# EAGLE design additionalShield (EAGLE 6.5.0)
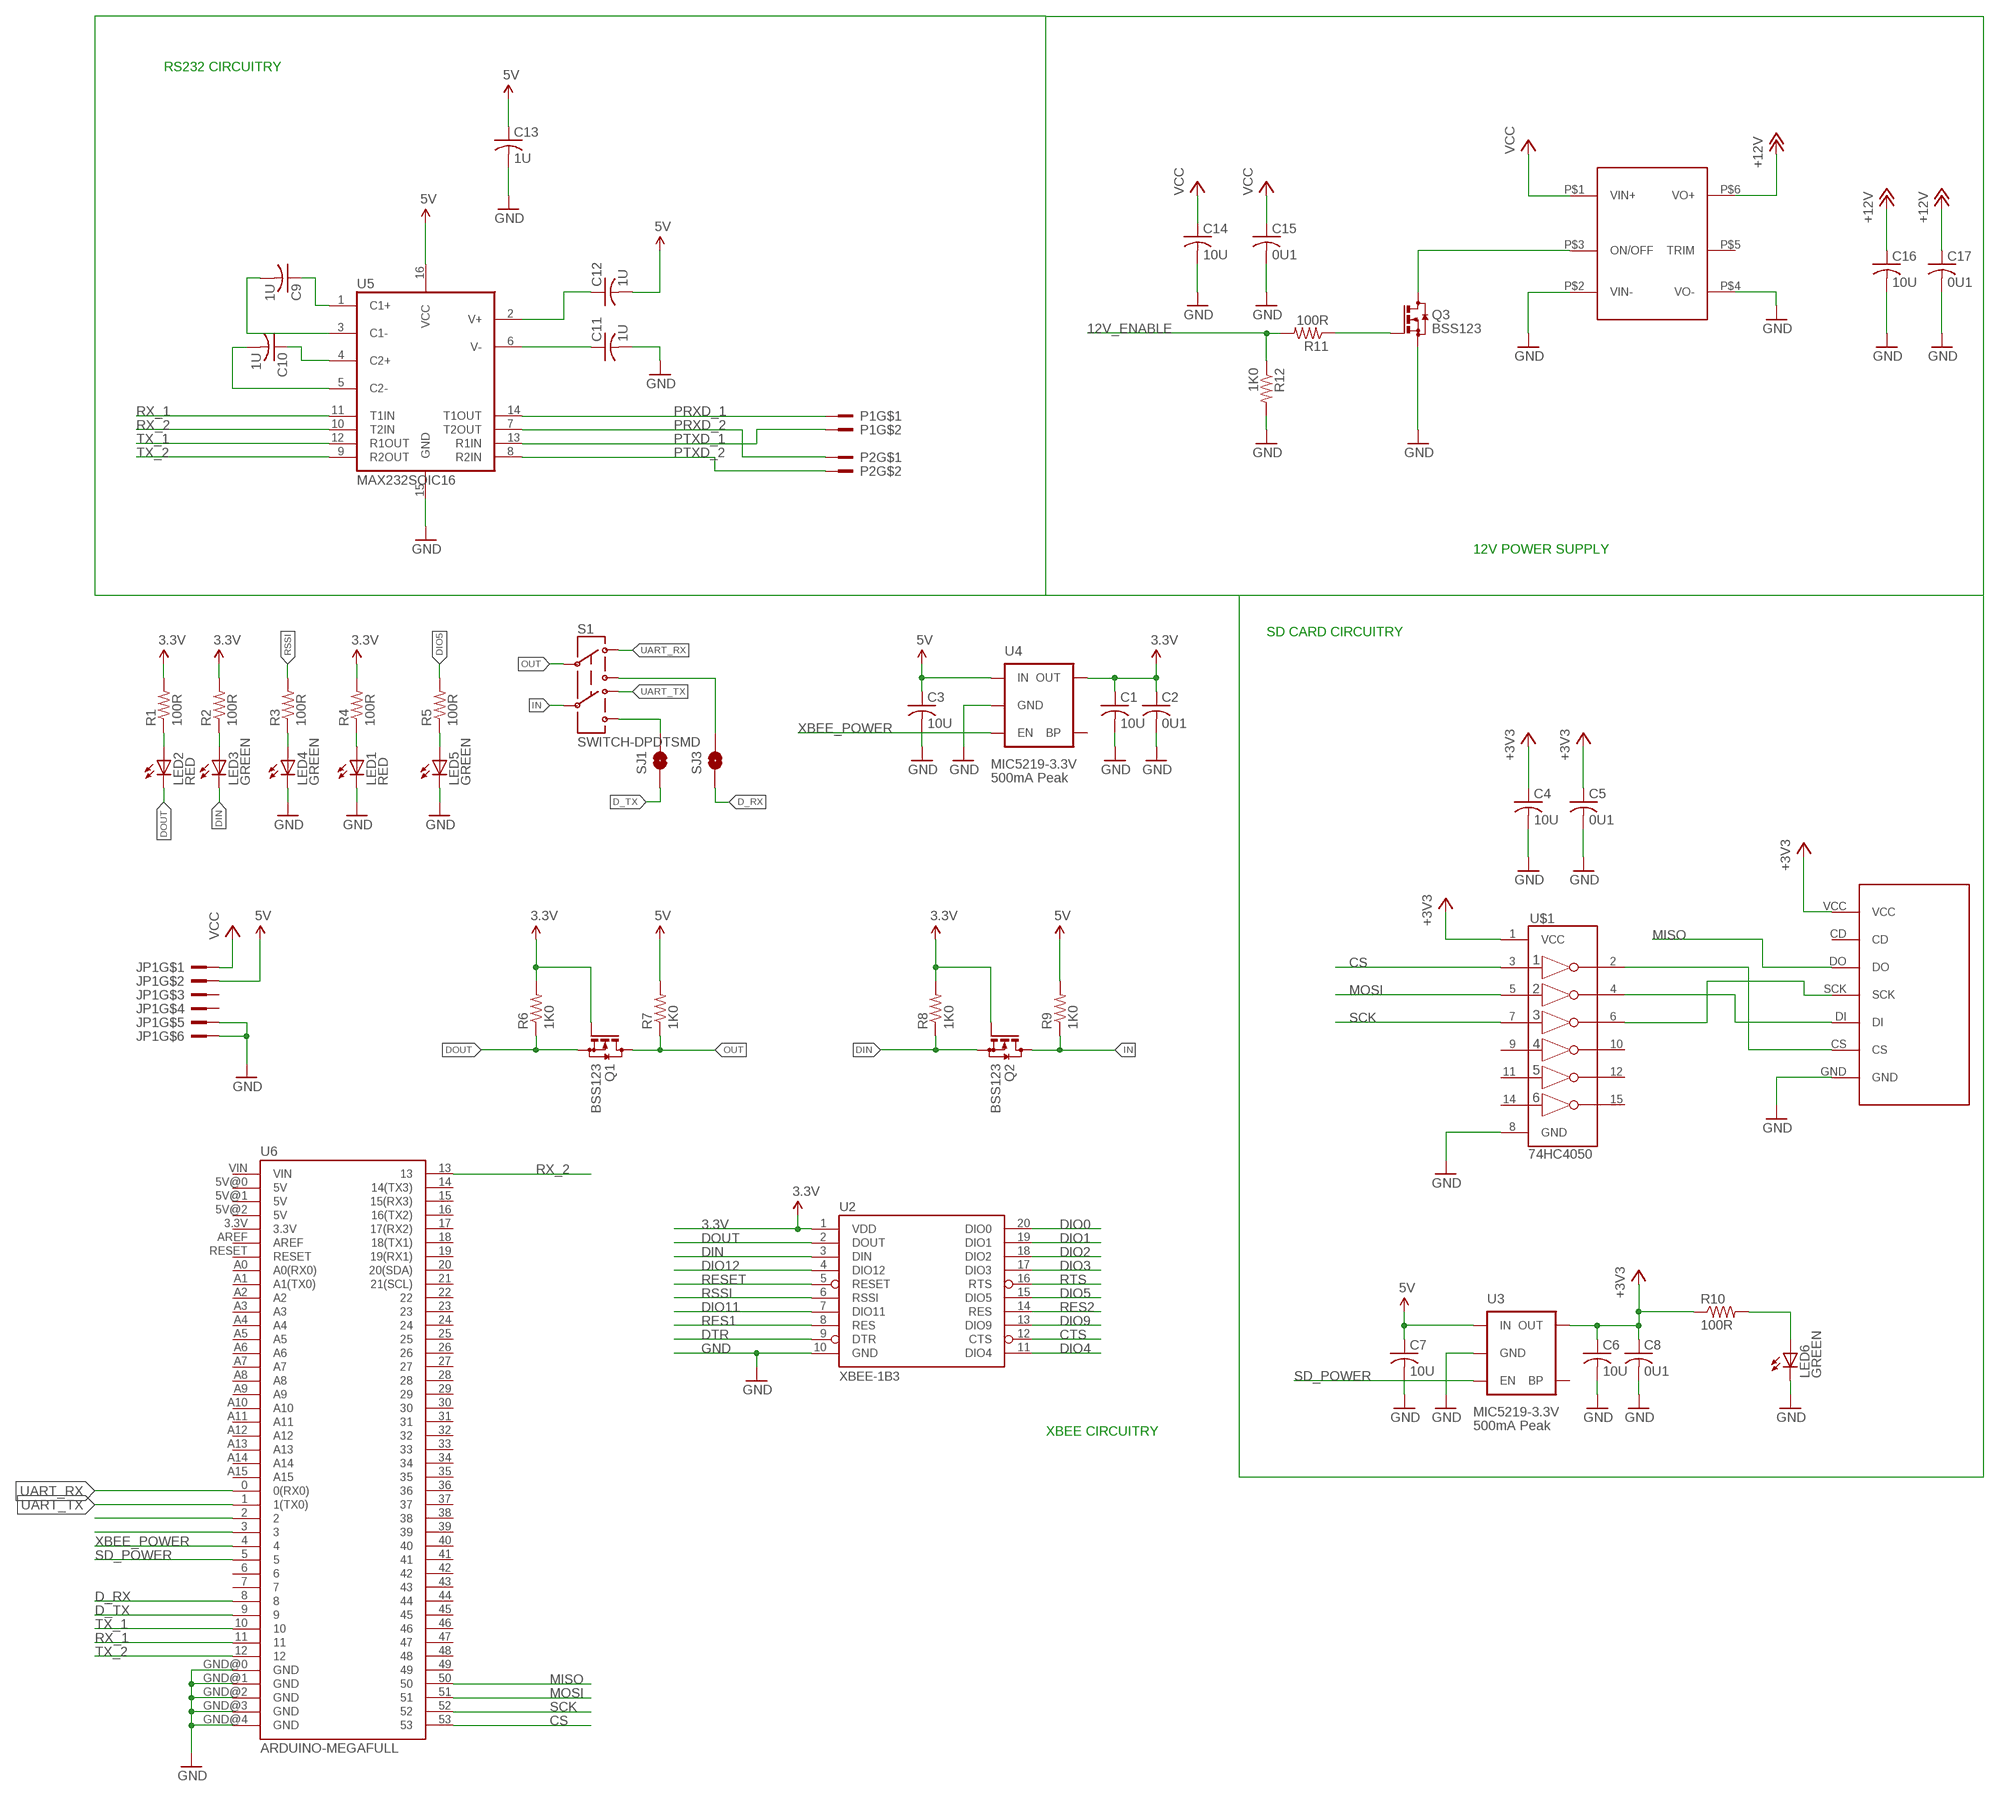
[diagram p0: schematic, sheet 1]

## Parts
C1  10U  C-USC1210K  [C1210K]
C2  0U1  C-USC1210K  [C1210K]
C3  10U  C-USC1210K  [C1210K]
C4  10U  C-USC1210K  [C1210K]
C5  0U1  C-USC1210K  [C1210K]
C6  10U  C-USC1210K  [C1210K]
C7  10U  C-USC1210K  [C1210K]
C8  0U1  C-USC1210K  [C1210K]
C9  1U  C-USC1210K  [C1210K]
C10  1U  C-USC1210K  [C1210K]
C11  1U  C-USC1210K  [C1210K]
C12  1U  C-USC1210K  [C1210K]
C13  1U  C-USC1210K  [C1210K]
C14  10U  C-USC1210K  [C1210K]
C15  0U1  C-USC1210K  [C1210K]
C16  10U  C-USC1210K  [C1210K]
C17  0U1  C-USC1210K  [C1210K]
JP1  6PIN2ROWARDUINO  [6PIN2ROWARDUINO]
LED1  RED  LEDCHIPLED_1206  [CHIPLED_1206]
LED2  RED  LEDCHIPLED_1206  [CHIPLED_1206]
LED3  GREEN  LEDCHIPLED_1206  [CHIPLED_1206]
LED4  GREEN  LEDCHIPLED_1206  [CHIPLED_1206]
LED5  GREEN  LEDCHIPLED_1206  [CHIPLED_1206]
LED6  GREEN  LEDCHIPLED_1206  [CHIPLED_1206]
P1  DF3A-2P-2DSA  [DF3A-2P-2DSA]
P2  DF3A-2P-2DSA  [DF3A-2P-2DSA]
Q1  BSS123  [SOT23]
Q2  BSS123  [SOT23]
Q3  BSS123  [SOT23]
R1  100R  R-US_R1206  [R1206]
R2  100R  R-US_R1206  [R1206]
R3  100R  R-US_R1206  [R1206]
R4  100R  R-US_R1206  [R1206]
R5  100R  R-US_R1206  [R1206]
R6  1K0  R-US_R1206  [R1206]
R7  1K0  R-US_R1206  [R1206]
R8  1K0  R-US_R1206  [R1206]
R9  1K0  R-US_R1206  [R1206]
R10  100R  R-US_R1206  [R1206]
R11  100R  R-US_R1206  [R1206]
R12  1K0  R-US_R1206  [R1206]
S1  SWITCH-DPDTSMD  [AYZ0202]
SJ1  D_TX  SOLDERJUMPERNC  [SJ_2S]
SJ3  D_RX  SOLDERJUMPERNC  [SJ_2S]
U2  XBEE-1B3  [XBEE-SMD]
U3  V_REG_LDOSMD  [SOT23-5]
U4  V_REG_LDOSMD  [SOT23-5]
U5  MAX232SOIC16  [SO016]
U6  ARDUINO-MEGAFULL  [ARDUINO_MEGA]
U$1  74HC4050  [SO16]
U$5  SD_BREAKOUT  [SD_BREAKOUT]
U$11  SHHD001A3B41Z  [SHHD001A3B41Z]

## Nets
3.3V: C1.1 C2.1 Q1.1(G) Q2.1(G) R1.2 R2.2 R4.2 R6.2 R8.2 U2.1(VDD) U4.5(OUT)
5V: C3.1 C7.1 C12.2 C13.1 JP1.P$2 R7.2 R9.2 U3.1(IN) U4.1(IN) U5.16(VCC)
12V_ENABLE: R11.2 R12.1
+3V3: C4.1 C5.1 C6.1 C8.1 R10.1 U3.5(OUT) U$1.1(VCC) U$5.VCC
+12V: C16.1 C17.1 U$11.P$6(VO+)
CS: U6.53 U$1.3(1A)
CTS: U2.12(CTS)
D_RX: SJ3.1 U6.8
D_TX: SJ1.1 U6.9
DIN: LED3.C Q2.2(S) R8.1 U2.3(DIN)
DIO0: U2.20(DIO0)
DIO1: U2.19(DIO1)
DIO2: U2.18(DIO2)
DIO3: U2.17(DIO3)
DIO4: U2.11(DIO4)
DIO5: R5.2 U2.15(DIO5)
DIO9: U2.13(DIO9)
DIO11: U2.7(DIO11)
DIO12: U2.4(DIO12)
DOUT: LED2.C Q1.2(S) R6.1 U2.2(DOUT)
DTR: U2.9(DTR)
GND: C1.2 C2.2 C3.2 C4.2 C5.2 C6.2 C7.2 C8.2 C11.2 C13.2 C14.2 C15.2 C16.2 C17.2 JP1.P$5 JP1.P$6 LED1.C LED4.C LED5.C LED6.C Q3.2(S) R12.2 U2.10(GND) U3.2(GND) U4.2(GND) U5.15(GND) U6.GND@0(GND) U6.GND@1(GND) U6.GND@2(GND) U6.GND@3(GND) U6.GND@4(GND) U$1.8(GND) U$5.GND U$11.P$2(VIN-) U$11.P$4(VO-)
IN: Q2.3(D) R9.1 S1.5
MISO: U6.50 U$5.DO
MOSI: U6.51 U$1.5(2A)
N$1: LED2.A R1.1
N$2: LED4.A R3.1
N$4: LED3.A R2.1
N$5: LED6.A R10.2
N$6: U$1.2(1Y) U$5.CS
N$7: U$1.4(2Y) U$5.DI
N$8: U$1.6(3Y) U$5.SCK
N$13: C9.1 U5.1(C1+)
N$14: C9.2 U5.3(C1-)
N$15: C10.1 U5.4(C2+)
N$16: C10.2 U5.5(C2-)
N$17: C11.1 U5.6(V-)
N$18: C12.1 U5.2(V+)
N$23: Q3.1(G) R11.1
N$24: U6.2
N$25: Q3.3(D) U$11.P$3(ON/OFF)
N$26: U6.3
N$38: LED1.A R4.1
N$139: LED5.A R5.1
N$140: S1.6 SJ1.2
N$141: S1.3 SJ3.2
OUT: Q1.3(D) R7.1 S1.2
PRXD_1: P1.P$1 U5.14(T1OUT)
PRXD_2: P2.P$1 U5.7(T2OUT)
PTXD_1: P1.P$2 U5.13(R1IN)
PTXD_2: P2.P$2 U5.8(R2IN)
RES1: U2.8(RES)
RES2: U2.14(RES)
RESET: U2.5(RESET)
RSSI: R3.2 U2.6(RSSI)
RTS: U2.16(RTS)
RX_1: U5.11(T1IN) U6.11
RX_2: U5.10(T2IN) U6.13
SCK: U6.52 U$1.7(3A)
SD_POWER: U3.3(EN) U6.5
TX_1: U5.12(R1OUT) U6.10
TX_2: U5.9(R2OUT) U6.12
UART_RX: S1.1 U6.0(0(RX0))
UART_TX: S1.4 U6.1(1(TX0))
VCC: C14.1 C15.1 JP1.P$1 U$11.P$1(VIN+)
XBEE_POWER: U4.3(EN) U6.4
Unconnected: JP1.P$3 JP1.P$4 U3.4(BP) U4.4(BP) U6.3.3V U6.5V@0(5V) U6.5V@1(5V) U6.5V@2(5V) U6.6 U6.7 U6.14(14(TX3)) U6.15(15(RX3)) U6.16(16(TX2)) U6.17(17(RX2)) U6.18(18(TX1)) U6.19(19(RX1)) U6.20(20(SDA)) U6.21(21(SCL)) U6.22 U6.23 U6.24 U6.25 U6.26 U6.27 U6.28 U6.29 U6.30 U6.31 U6.32 U6.33 U6.34 U6.35 U6.36 U6.37 U6.38 U6.39 U6.40 U6.41 U6.42 U6.43 U6.44 U6.45 U6.46 U6.47 U6.48 U6.49 U6.A0(A0(RX0)) U6.A1(A1(TX0)) U6.A2 U6.A3 U6.A4 U6.A5 U6.A6 U6.A7 U6.A8 U6.A9 U6.A10 U6.A11 U6.A12 U6.A13 U6.A14 U6.A15 U6.AREF U6.RESET U6.VIN U$1.9(4A) U$1.10(4Y) U$1.11(5A) U$1.12(5Y) U$1.14(6A) U$1.15(6Y) U$5.CD U$11.P$5(TRIM)

## Notes on the sheet
- RS232 CIRCUITRY
- 12V POWER SUPPLY
- SD CARD CIRCUITRY
- MIC5219-3.3V
- 500mA Peak
- MIC5219-3.3V
- 500mA Peak
- XBEE CIRCUITRY

## Library data of the parts
C1-C17 = resistor:C-US: CAPACITOR, American symbol
JP1 = con-3m:6PIN2ROWARDUINO
LED1-LED6 = led:LED: LED OSRAM: - CHIPLED LG R971, LG N971, LY N971, LG Q971, LY Q971, LO R971, LY R971 LH N974, LH R974 LS Q976, LO Q976, LY Q976 LO Q996 - Hyper CHIPLED LW Q18S LB Q993, LB Q99A, LB R99A - SideLED LS A670, LO A670, LY A670, LG A670, LP A670 LB A673, LV A673, LT A673, LW A673 LH A674 LY A675 LS A676, LA A676, LO A676, LY A676, LW A676 LS A679, LY A679, LG A679 - Hyper Micro SIDELED® LS Y876, LA Y876, LO Y876, LY Y876 LT Y87S - SmartLED LW L88C, LW L88S LB L89C, LB L89S, LG L890 LS L89K, LO L89K, LY L89K LS L896, LA L896, LO L896, LY L896 - TOPLED LS T670, LO T670, LY T670, LG T670, LP T670 LSG T670, LSP T670, LSY T670, LOP T670, LYG T670 LG T671, LOG T671, LSG T671 LB T673, LV T673, LT T673, LW T673 LH T674 LS T676, LA T676, LO T676, LY T676, LB T676, LH T676, LSB T676, LW T676 LB T67C, LV T67C, LT T67C, LS T67K, LO T67K, LY T67K, LW E67C LS E67B, LA E67B, LO E67B, LY E67B, LB E67C, LV E67C, LT E67C LW T67C LS T679, LY T679, LG T679 LS T770, LO T770, LY T770, LG T770, LP T770 LB T773, LV T773, LT T773, LW T773 LH T774 LS E675, LA E675, LY E675, LS T675 LS T776, LA T776, LO T776, LY T776, LB T776 LHGB T686 LT T68C, LB T68C - Hyper Mini TOPLED® LB M676 - Mini TOPLED Santana® LG M470 LS M47K, LO M47K, LY M47K Source: http://www.osram.convergy.de LUXEON: - LUMILED® LXK2-PW12-R00, LXK2-PW12-S00, LXK2-PW14-U00, LXK2-PW14-V00 LXK2-PM12-R00, LXK2-PM12-S00, LXK2-PM14-U00 LXK2-PE12-Q00, LXK2-PE12-R00, LXK2-PE12-S00, LXK2-PE14-T00, LXK2-PE14-U00 LXK2-PB12-K00, LXK2-PB12-L00, LXK2-PB12-M00, LXK2-PB14-N00, LXK2-PB14-P00, LXK2-PB14-Q00 LXK2-PR12-L00, LXK2-PR12-M00, LXK2-PR14-Q00, LXK2-PR14-R00 LXK2-PD12-Q00, LXK2-PD12-R00, LXK2-PD12-S00 LXK2-PH12-R00, LXK2-PH12-S00 LXK2-PL12-P00, LXK2-PL12-Q00, LXK2-PL12-R00 Source: www.luxeon.com KINGBRIGHT: KA-3528ASYC Source: www.kingbright.com
P1 P2 = con-3m:DF3A-2P-2DSA
Q1-Q3 = transistor-small-signal:BSS123: N-CHANNEL MOS FET
R1-R12 = resistor:R-US_: RESISTOR, American symbol
S1 = SparkFun:SWITCH-DPDT: DPDT Version of the COM-00597
SJ1 SJ3 = SparkFun:SOLDERJUMPER: Solder Jumper Standard SMD solder jumper. Used to automate production. Two varients : Normally Open and Normally Closed are the same, but have different paste layers. NC will have a large amount of paste and should jumper during reflow.
U2 = SparkFun:XBEE-1
U3 U4 = SparkFun-PowerIC:V_REG_LDO: Voltage Regulator LDO Standard 150mA LDO voltage regulator in SOT-23 layout. Micrel part MIC5205. BP (by-pass) pin is used to lower output noise with 470pF cap.
U5 = SparkFun-DigitalIC:MAX232: RS232 Transceiver Very common IC. This is generically called 'MAX232', but works with the 3V equivalent MAX3232 generic ICs. Field tested and mother approved. Spark Fun Electronics SKU : COM-00316 (DIP) and COM-00589 (SMD)
U6 = SparkFun-Boards:ARDUINO-MEGA: Arduino Mega board footprint
U$1 = SparkFun-DigitalIC:74HC4050
U$5 = SparkFun-Boards:SD_BREAKOUT
U$11 = dc-dc-converter:SHHD001A3B41Z

## Net classes
0 default: width 0.203 mm
1 vcc: width 0.305 mm

## Board
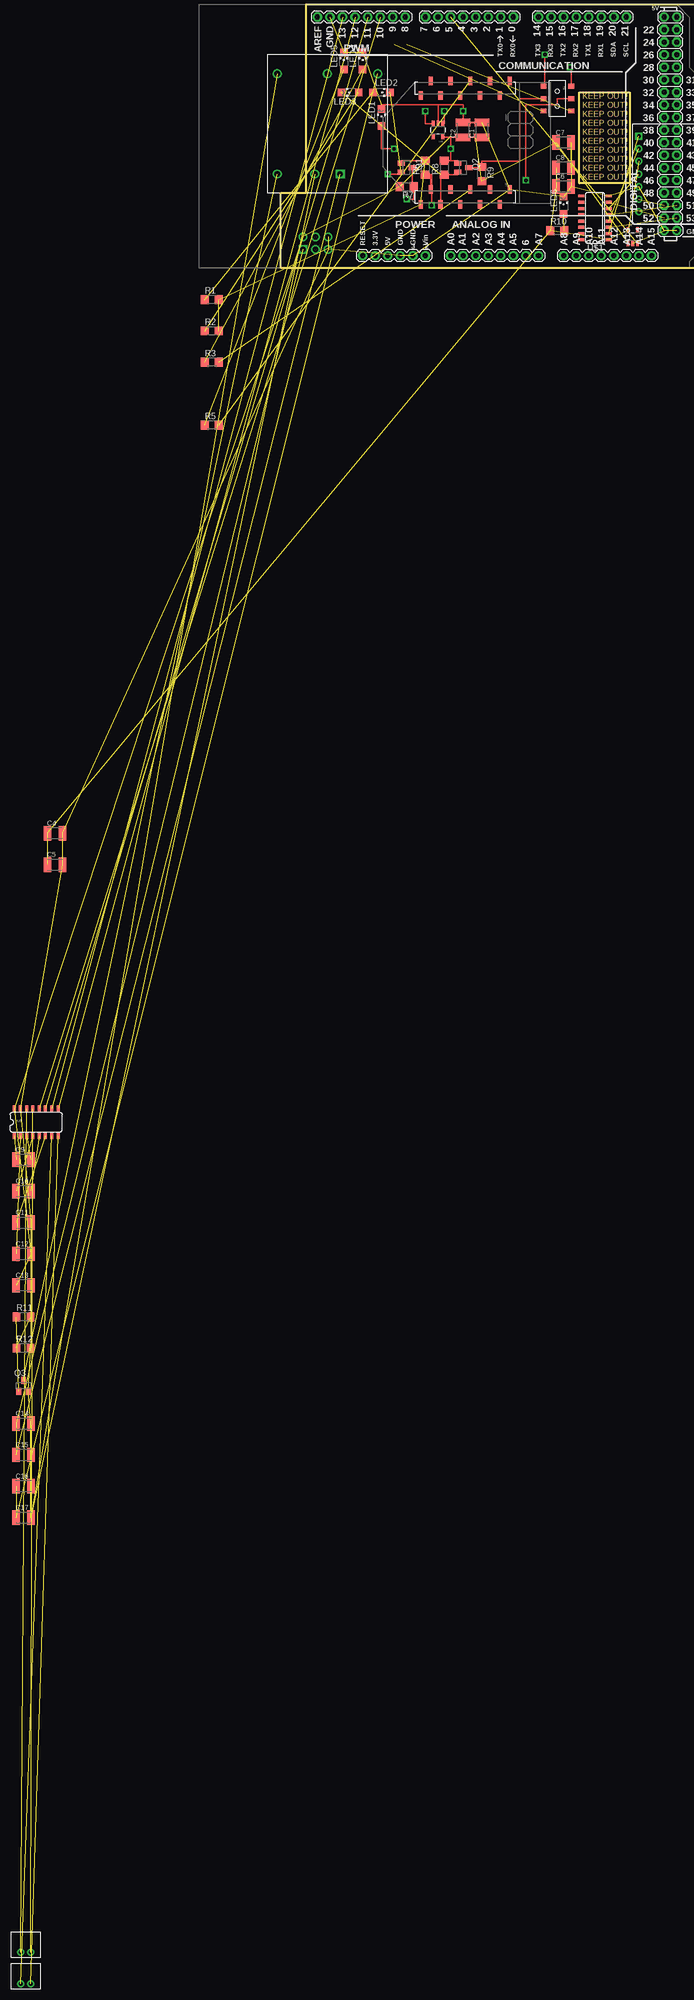
[diagram p1: board, top side]
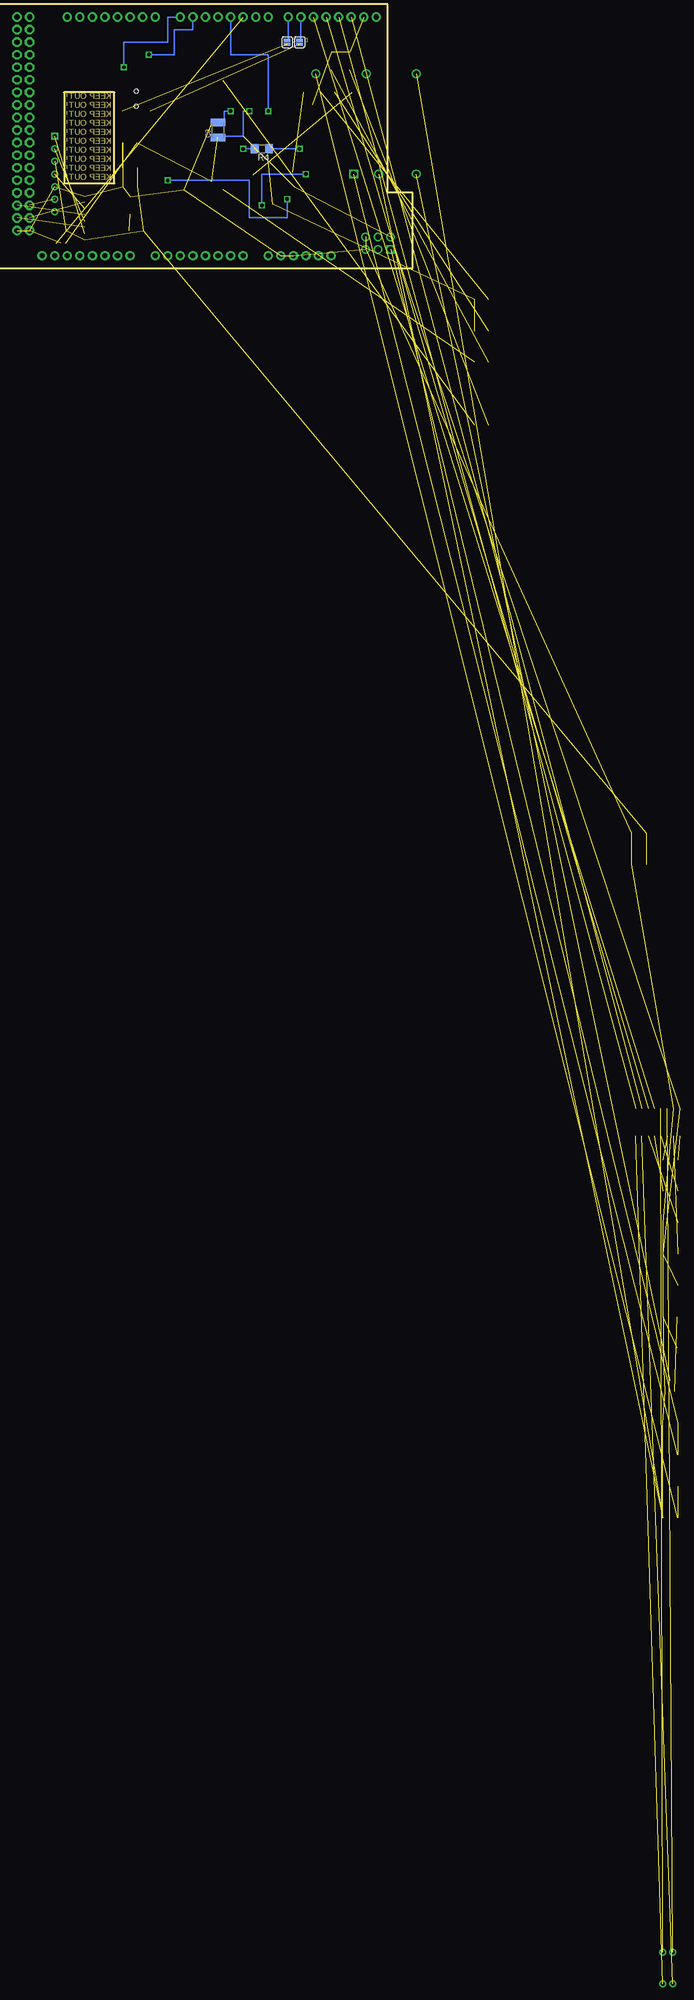
[diagram p2: board, bottom side, seen from below]

No outline drawn. Coordinates in mm, seen from the top.
Copper layers (1*16): Top 0.035mm / dielectric 1.5mm / Bottom 0.035mm
Design rules "SparkFun-2-layer": minimum track width 7mil, minimum drill 15mil, track to track 8mil, track to pad 8mil, pad to pad 8mil, via to via 8mil, smd to smd 8mil, copper to edge 8mil, drill to drill 8mil, minimum pad ring 12mil, minimum via ring 10mil, stop-mask expansion 4mil, vias tented up to drill 20mil, thermal gap 10mil
Milling: 10 lines

### Footprints (pad centres in the part's own frame; a part is rotated, then mirrored left to right if it is on the bottom)
C1210K = smd 1.5 x 2.9: 1 -1.5,0; 2 1.5,0
6PIN2ROWARDUINO = drill 1.1 square: P$1 0,0 | drill 1.1: P$2 0,2.54; P$3 2.54,0; P$4 2.54,2.54; P$5 5.08,0; P$6 5.08,2.54
CHIPLED_1206 = smd 1.5 x 1.5: A 0,-1.75; C 0,1.75
DF3A-2P-2DSA = drill 0.8: P$1 2,1.001; P$2 4,1.001
SOT23 = smd 1 x 1.4: 1 -0.95,-1.1; 2 0.95,-1.1; 3 0,1.1
R1206 = smd 1.6 x 1.803: 1 -1.422,0; 2 1.422,0
AYZ0202 = smd 1 x 1.15: 1 -2.5,2.825; 2 0,2.825; 3 2.5,2.825; 4 -2.5,-2.825; 5 0,-2.825; 6 2.5,-2.825 | hole 0.85: 1.5,0; -1.5,0
SJ_2S = smd 0.635 x 1.27: 1 -0.412,0; 2 0.412,0
XBEE-SMD = smd 1.7 x 0.85: 1 -12.5,20; 2 -9.5,18; 3 -12.5,16; 4 -9.5,14; 5 -12.5,12; 6 -9.5,10; 7 -12.5,8; 8 -9.5,6; 9 -12.5,4; 10 -9.5,2; 11 12.5,2; 12 9.5,4; 13 12.5,6; 14 9.5,8; 15 12.5,10; 16 9.5,12; 17 12.5,14; 18 9.5,16; 19 12.5,18; 20 9.5,20
SOT23-5 = smd 0.55 x 1.2: 1 -0.95,-1.3; 2 0,-1.3; 3 0.95,-1.3; 4 0.95,1.3; 5 -0.95,1.3
SO016 = smd 0.6 x 1.2: 1 -4.445,-2.8; 2 -3.175,-2.8; 3 -1.905,-2.8; 4 -0.635,-2.8; 5 0.635,-2.8; 6 1.905,-2.8; 7 3.175,-2.8; 8 4.445,-2.8; 9 4.445,2.8; 10 3.175,2.8; 11 1.905,2.8; 12 0.635,2.8; 13 -0.635,2.8; 14 -1.905,2.8; 15 -3.175,2.8; 16 -4.445,2.8
ARDUINO_MEGA = drill 1.016 pad 1.88: 0 63.5,50.8; 1 60.96,50.8; 2 58.42,50.8; 3 55.88,50.8; 3.3V 35.56,2.54; 4 53.34,50.8; 5 50.8,50.8; 5V@0 38.1,2.54; 5V@1 93.98,50.8; 5V@2 96.52,50.8; 6 48.26,50.8; 7 45.72,50.8; 8 41.656,50.8; 9 39.116,50.8; 10 36.576,50.8; 11 34.036,50.8; 12 31.496,50.8; 13 28.956,50.8; 14 68.58,50.8; 15 71.12,50.8; 16 73.66,50.8; 17 76.2,50.8; 18 78.74,50.8; 19 81.28,50.8; 20 83.82,50.8; 21 86.36,50.8; A0 50.8,2.54; A1 53.34,2.54; A2 55.88,2.54; A3 58.42,2.54; A4 60.96,2.54; A5 63.5,2.54; A6 66.04,2.54; A7 68.58,2.54; A8 73.66,2.54; A9 76.2,2.54; A10 78.74,2.54; A11 81.28,2.54; A12 83.82,2.54; A13 86.36,2.54; A14 88.9,2.54; A15 91.44,2.54; AREF 23.876,50.8; GND@0 40.64,2.54; GND@1 43.18,2.54; GND@2 93.98,7.62; GND@3 96.52,7.62; GND@4 26.416,50.8; RESET 33.02,2.54; VIN 45.72,2.54 | drill 1.016 pad 1.88 octagon: 22 93.98,48.26; 23 96.52,48.26; 24 93.98,45.72; 25 96.52,45.72; 26 93.98,43.18; 27 96.52,43.18; 28 93.98,40.64; 29 96.52,40.64; 30 93.98,38.1; 31 96.52,38.1; 32 93.98,35.56; 33 96.52,35.56; 34 93.98,33.02; 35 96.52,33.02; 36 93.98,30.48; 37 96.52,30.48; 38 93.98,27.94; 39 96.52,27.94; 40 93.98,25.4; 41 96.52,25.4; 42 93.98,22.86; 43 96.52,22.86; 44 93.98,20.32; 45 96.52,20.32; 46 93.98,17.78; 47 96.52,17.78; 48 93.98,15.24; 49 96.52,15.24; 50 93.98,12.7; 51 96.52,12.7; 52 93.98,10.16; 53 96.52,10.16
SO16 = smd 0.6 x 1.2: 1 -4.445,-2.8; 2 -3.175,-2.8; 3 -1.905,-2.8; 4 -0.635,-2.8; 5 0.635,-2.8; 6 1.905,-2.8; 7 3.175,-2.8; 8 4.445,-2.8; 9 4.445,2.8; 10 3.175,2.8; 11 1.905,2.8; 12 0.635,2.8; 13 -0.635,2.8; 14 -1.905,2.8; 15 -3.175,2.8; 16 -4.445,2.8
SD_BREAKOUT = drill 0.8: CD 0,15.24; DI 0,2.54; DO 0,12.7; GND 0,10.16; SCK 0,7.62; VCC 0,5.08 | drill 0.8 square: CS 0,0
SHHD001A3B41Z = drill 1.2 square: P$1 3.81,9.652 | drill 1.2: P$2 3.81,14.732; P$3 3.81,22.352; P$4 24.13,22.352; P$5 24.13,12.192; P$6 24.13,2.032

### Placement (x,y rotation side)
C1  57.15,27.94 90 top
C2  53.34,27.94 90 top
C3  55.88,27.94 90 bottom
C4  -29.21,-114.3 0 top
C5  -29.21,-120.65 0 top
C6  73.66,16.51 0 top
C7  73.66,25.4 0 top
C8  73.66,20.32 0 top
C9  -35.56,-180.34 0 top
C10  -35.56,-186.69 0 top
C11  -35.56,-193.04 0 top
C12  -35.56,-199.39 0 top
C13  -35.56,-205.74 0 top
C14  -35.56,-233.68 0 top
C15  -35.56,-240.03 0 top
C16  -35.56,-246.38 0 top
C17  -35.56,-252.73 0 top
JP1  20.95,3.81 0 top
LED1  36.83,30.48 0 top
LED2  36.83,35.56 270 top
LED3  30.48,35.56 90 top
LED4  33.02,41.91 0 top
LED5  29.21,41.91 0 top
LED6  73.66,12.7 0 top
P1  -38.1,-341.63 0 top
P2  -38.1,-347.98 0 top
Q1  41.91,20.32 270 top
Q2  53.34,20.32 270 top
Q3  -35.56,-226.06 0 top
R1  2.54,-6.35 0 top
R2  2.54,-12.7 0 top
R3  2.54,-19.05 0 top
R4  46.99,24.13 180 bottom
R5  2.54,-31.75 0 top
R6  45.72,20.32 90 top
R7  41.91,16.51 180 top
R8  49.53,20.32 90 top
R9  57.15,19.05 270 top
R10  72.39,7.62 0 top
R11  -35.56,-212.09 0 top
R12  -35.56,-218.44 0 top
S1  72.39,34.29 270 top
SJ1  39.37,45.72 270 bottom
SJ3  41.91,45.72 270 bottom
U2  64.77,25.4 90 top
U3  87.63,6.35 0 top
U4  48.26,27.94 180 top
U5  -33.02,-172.72 0 top
U6  0,0 0 top
U$1  80.01,10.16 90 top
U$5  88.9,26.67 180 top
U$11  38.1,15.24 90 top

### Tracks (layer width: path | path; a pad name or v marks a point on that pad's centre or on a via)
3.3V  (via drill 0.7)  (4 unrouted)
  Top 0.254: C1.1 C2.1 50.8,26.44 | 50.8,26.44 49.21,26.44 U4.5 | Q2.1 52.24,21.74 R8.2 50.8,21.74 v50.8,24.13 50.8,26.44 | R6.2 40.81,21.74 Q1.1
  Bottom 0.254: R4.2 v50.8,24.13
5V  (via drill 0.7)  (8 unrouted)
  Top 0.254: U4.1 49.53,29.24 v49.53,31.75
  Bottom 0.254: v49.53,31.75 50.8,31.75 50.8,26.67 55.88,26.67 C3.1
12V_ENABLE  (1 unrouted)
+3V3  (7 unrouted)
+12V  (2 unrouted)
CS  (1 unrouted)
D_RX
  Bottom 0.254: SJ3.1 41.66,46.13 U6.8
D_TX
  Bottom 0.254: SJ1.1 39.12,46.13 U6.9
DIN  (1 unrouted)
  Top 0.254: Q2.2 52.24,18.9 R8.1 48.77,18.9 U2.3
DIO5  (1 unrouted)
DOUT  (via drill 0.7)  (1 unrouted)
  Top 0.254: U2.2 46.77,18.9 R6.1 46.99,18.9 v46.99,12.7 | v38.1,19.05 40.81,19.05 Q1.2
  Bottom 0.254: v46.99,12.7 46.99,19.05 v38.1,19.05
GND  (via drill 0.7)  (30 unrouted)
  Top 0.254: C2.2 v53.34,31.75 53.34,33.02 48.26,33.02 | U4.2 48.26,33.02 | LED1.C 36.83,33.02 48.26,33.02
  Top 0.406: C1.2 C2.2
  Bottom 0.254: v53.34,31.75 54.61,31.75 54.61,29.21 55.88,29.21 C3.2
IN
  Top 0.254: Q2.3 57.15,20.32 R9.1 57.15,21.59 64.77,21.59 64.77,34.29 S1.5
MISO  (1 unrouted)
MOSI  (1 unrouted)
N$1  (1 unrouted)
N$2  (1 unrouted)
N$4  (1 unrouted)
N$5  (1 unrouted)
N$6  (1 unrouted)
N$7  (1 unrouted)
N$8  (1 unrouted)
N$13  (1 unrouted)
N$14  (1 unrouted)
N$15  (1 unrouted)
N$16  (1 unrouted)
N$17  (1 unrouted)
N$18  (1 unrouted)
N$23  (1 unrouted)
N$25  (1 unrouted)
N$38  (via drill 0.7)
  Top 0.254: v39.37,24.13 36.83,24.13 LED1.A
  Bottom 0.254: R4.1 v39.37,24.13
N$139  (1 unrouted)
N$140  (1 unrouted)
N$141  (1 unrouted)
OUT  (via drill 0.7)
  Top 0.254: Q1.3 43.01,16.51 R7.1 43.33,13.97 v41.91,13.97 | S1.2 72.39,34.29 72.39,33.02 66.04,33.02 v66.04,17.78
  Bottom 0.254: v66.04,17.78 49.53,17.78 49.53,10.16 41.91,10.16 v41.91,13.97
PRXD_1  (1 unrouted)
PRXD_2  (1 unrouted)
PTXD_1  (1 unrouted)
PTXD_2  (1 unrouted)
RSSI  (1 unrouted)
RX_1  (1 unrouted)
RX_2  (1 unrouted)
SCK  (1 unrouted)
SD_POWER  (1 unrouted)
TX_1  (1 unrouted)
TX_2  (1 unrouted)
UART_RX  (via drill 0.7)
  Top 0.254: v74.93,40.64 75.22,40.64 S1.1
  Bottom 0.254: U6.0 66.04,50.8 66.04,45.72 74.93,45.72 v74.93,40.64
UART_TX  (via drill 0.7)
  Top 0.254: S1.4 69.85,36.79 v69.85,43.18
  Bottom 0.254: v69.85,43.18 64.77,43.18 64.77,48.26 60.96,48.26 U6.1
VCC  (3 unrouted)
XBEE_POWER  (via drill 0.7)
  Top 0.254: U4.3 45.72,29.24 v45.72,31.75
  Bottom 0.254: v45.72,31.75 45.72,43.18 53.34,43.18 U6.4

### Text on the board
Dimension: KEEP OUT!! / KEEP OUT!! / KEEP OUT!! / KEEP OUT!! / KEEP OUT!! / KEEP OUT!! / KEEP OUT!! / KEEP OUT!! / KEEP OUT!! / KEEP OUT!!
tPlace: 3 | 2